# Altium schematic sheet 01_Filtr2.SchDoc
size A4; Organization: OLTEST; Revision: 01; SheetNumber: 1; SheetTotal: 2; Файл: SourceBoard_v1; Разработчик: Бондарчук С.; Прибор: R100; АМАК.000000.000 Э3: R100.220.020.000 Э3; Дата: 10.12.2017; Формат: A4; PageSetup: Record=PageOptions|CenterHorizontal=True|CenterVertical=True|PrintScale=0.97|XCorrection=1.00|YCorrection=1.00|PrintKind=1|BorderSize=5000000|LeftOffset=0|BottomOffset=0|Orientation=2|PaperLength=2970|PaperWidth=2100|Scale=100|PaperSource=7|PrintQuality=600|MediaType=1|DitherType=10|PrintScaleMode=1|PaperKind=A4|PaperIndex=9
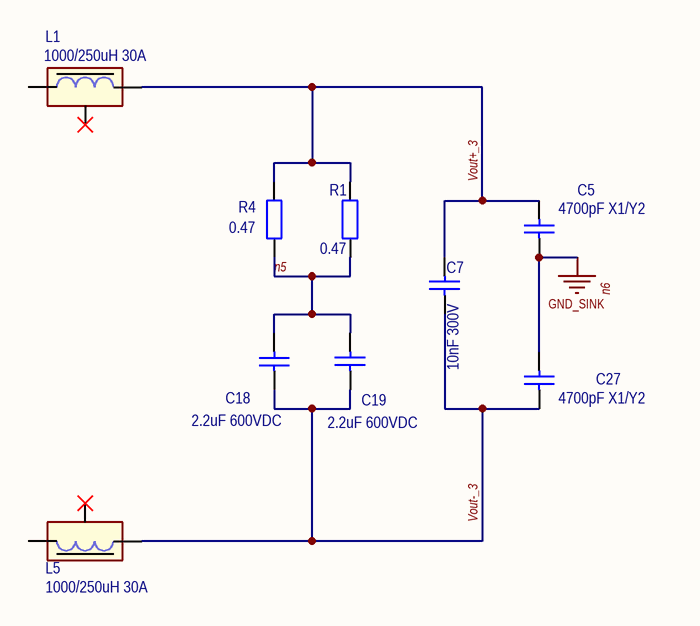
[diagram p0: 01_Filtr2.SchDoc]

## Parts
C5  4700pF X1/Y2  [SMD_C_2220]
C7  10nF 300V  [C Y2 D13 7.5b]
C18  2.2uF 600VDC  [MKP_W20_H39.5_L41.5_LS37.5]
C19  2.2uF 600VDC  [MKP_W20_H39.5_L41.5_LS37.5]
C27  4700pF X1/Y2  [SMD_C_2220]
L1  1000/250uH 30A  [Dross (1000/250 uH 30 A)AMAK.671111.033]
L5  1000/250uH 30A  [Dross (1000/250 uH 30 A)AMAK.671111.033]
R1  0.47  [PRW 10W 2050]
R4  0.47  [PRW 10W 2050]

## Nets
GND_SINK: C5.1 C27.2
n5: C18.1 C19.2 R1.1 R4.1
Vout+_3: C5.2 C7.2 L1.2 R1.2 R4.2
Vout-_3: C7.1 C18.2 C19.1 C27.1 L5.1

Not connected (* = marked no-connect by the designer): L1 1 3*; L5 2 3*

## Notes on the sheet
- Labels drawn without touching a wire or pin: n6
- Разработчик:
- Формат:
- Rev.:
- Лист
- Дата:
- Листов
- Файл:
- Дата изм.:

## Library data of the parts
C5 C27 = C X1Y2 4700pF SMD 2220 250Vac 10%: SMD C2220 MURATA 250Vac 10% X7R X1Y2; PartNumber: DE2E3KY472MA3; Manufacturer: MURATA; Value: 4700pF X1/Y2
C7 = C X1Y2 10nF D13 LS7.5: Ceramic D=14 LS=7.5 300VAC X1Y2; PartNumber: DE2F3KY103MA3; Manufacturer: Murata; Value: 10nF 300V
C18 C19 = MKP1 2.2uF 10% 600VDC: Polypropelene W20 H39.5 L41.5 LS37.5 600VDC 10%; PartNumber: MKP1J042207G00K; Manufacturer: Wima; Value: 2.2uF 600VDC
L1 L5 = Dross 1000/250uH 30A R100.20.58.11.00: 1000/250uH 30A  (Core T250-52 X2); Manufacturer: OLTEST; PartNumber: R100.20.58.11.00; Value: 1000/250uH 30A
R1 R4 = PRW 0.47 10W +-5%: Выводной PRW 10W 0R47 +-5%; PartNumber: PRW0AWJW47K; Manufacturer: RoyalOhm; Value: 0.47